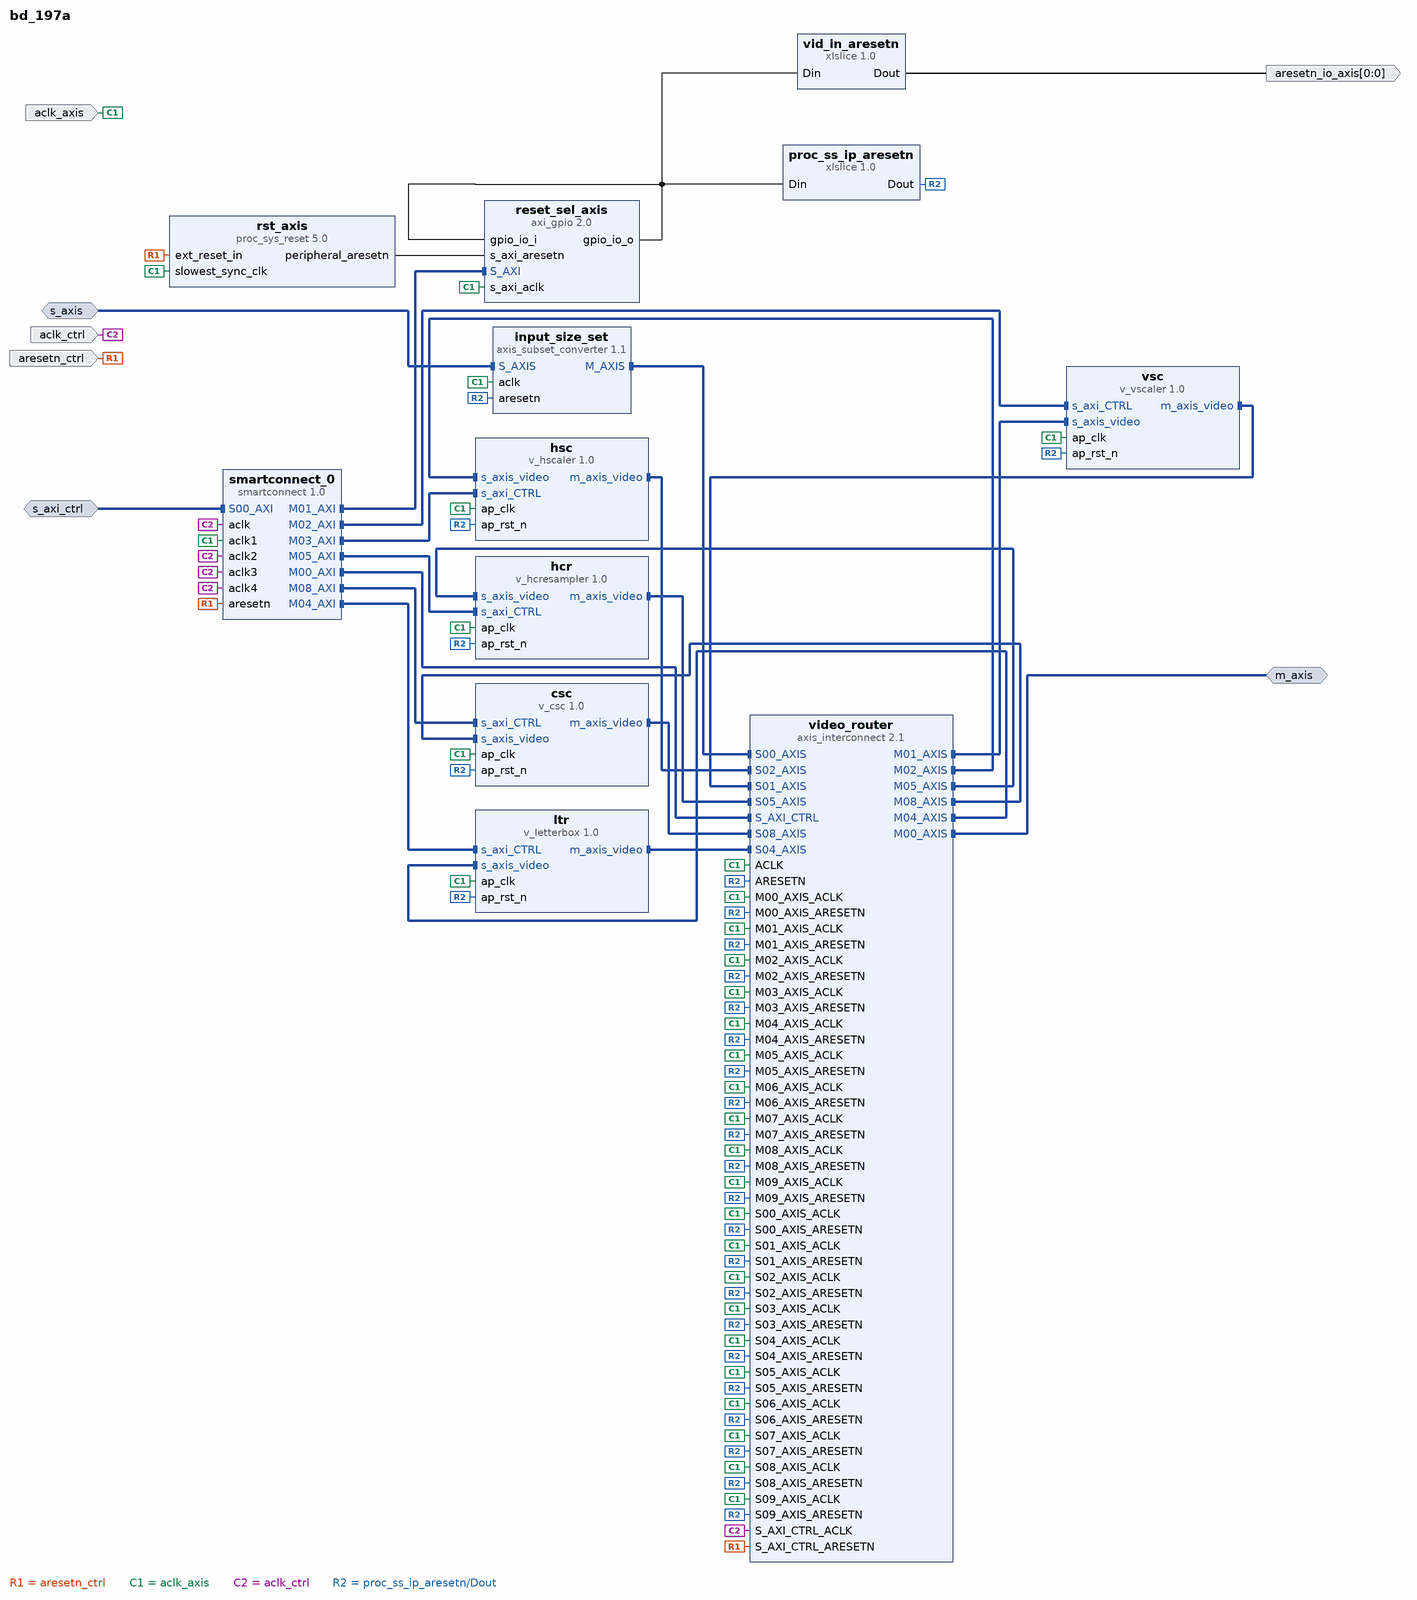
[diagram p0: block diagram of the top level]
# Vivado block design bd_197a, xc7z020clg484-1, Vivado 2020.1
create_bd_design bd_197a

create_bd_intf_port -mode Slave -vlnv xilinx.com:interface:aximm_rtl:1.0 s_axi_ctrl
set_property -dict [list \
  CONFIG.PROTOCOL AXI4LITE \
  CONFIG.ADDR_WIDTH 19 \
  CONFIG.SUPPORTS_NARROW_BURST 0 \
  CONFIG.NUM_READ_OUTSTANDING 1 \
  CONFIG.NUM_WRITE_OUTSTANDING 1 \
  CONFIG.MAX_BURST_LENGTH 1 \
  CONFIG.master_id 0 \
] [get_bd_intf_ports s_axi_ctrl]
create_bd_intf_port -mode Slave -vlnv xilinx.com:interface:axis_rtl:1.0 s_axis
create_bd_intf_port -mode Master -vlnv xilinx.com:interface:axis_rtl:1.0 m_axis
create_bd_port -dir I -type clk aclk_axis
create_bd_port -dir I -type clk aclk_ctrl
create_bd_port -dir I -type rst aresetn_ctrl
set_property -dict {CONFIG.POLARITY ACTIVE_LOW} [get_bd_ports aresetn_ctrl]
create_bd_port -dir O -from 0 -to 0 -type rst aresetn_io_axis

create_bd_cell -type ip -vlnv xilinx.com:ip:smartconnect:1.0 smartconnect_0
set_property -dict {CONFIG.HAS_ARESETN 1 CONFIG.NUM_CLKS 5 CONFIG.NUM_MI 12 CONFIG.NUM_SI 1} [get_bd_cells smartconnect_0]
create_bd_cell -type ip -vlnv xilinx.com:ip:v_vscaler:1.0 vsc
set_property -dict [list \
  CONFIG.ENABLE_420 0 \
  CONFIG.MAX_COLS 3840 \
  CONFIG.MAX_DATA_WIDTH 8 \
  CONFIG.MAX_ROWS 2160 \
  CONFIG.SAMPLES_PER_CLOCK 1 \
  CONFIG.SCALE_MODE 2 \
  CONFIG.TAPS 6 \
  CONFIG.USE_URAM 0 \
] [get_bd_cells vsc]
create_bd_cell -type ip -vlnv xilinx.com:ip:v_hscaler:1.0 hsc
set_property -dict [list \
  CONFIG.ENABLE_420 0 \
  CONFIG.ENABLE_422 1 \
  CONFIG.ENABLE_CSC 0 \
  CONFIG.MAX_COLS 3840 \
  CONFIG.MAX_DATA_WIDTH 8 \
  CONFIG.MAX_ROWS 2160 \
  CONFIG.SAMPLES_PER_CLOCK 1 \
  CONFIG.SCALE_MODE 2 \
  CONFIG.TAPS 6 \
  CONFIG.USE_URAM 0 \
] [get_bd_cells hsc]
create_bd_cell -type ip -vlnv xilinx.com:ip:axis_subset_converter:1.1 input_size_set
set_property -dict [list \
  CONFIG.M_HAS_TKEEP 1 \
  CONFIG.M_HAS_TSTRB 1 \
  CONFIG.M_TDEST_WIDTH 1 \
  CONFIG.M_TID_WIDTH 1 \
  CONFIG.S_HAS_TKEEP 1 \
  CONFIG.S_HAS_TLAST 1 \
  CONFIG.S_HAS_TSTRB 1 \
  CONFIG.S_TDATA_NUM_BYTES 3 \
  CONFIG.S_TDEST_WIDTH 1 \
  CONFIG.S_TID_WIDTH 1 \
  CONFIG.S_TUSER_WIDTH 1 \
] [get_bd_cells input_size_set]
create_bd_cell -type ip -vlnv xilinx.com:ip:v_letterbox:1.0 ltr
set_property -dict [list \
  CONFIG.MAX_COLS 3840 \
  CONFIG.MAX_DATA_WIDTH 8 \
  CONFIG.MAX_ROWS 2160 \
  CONFIG.SAMPLES_PER_CLOCK 1 \
] [get_bd_cells ltr]
create_bd_cell -type ip -vlnv xilinx.com:ip:v_csc:1.0 csc
set_property -dict [list \
  CONFIG.ENABLE_420 0 \
  CONFIG.ENABLE_422 1 \
  CONFIG.ENABLE_WINDOW 0 \
  CONFIG.MAX_DATA_WIDTH 8 \
  CONFIG.SAMPLES_PER_CLOCK 1 \
  CONFIG.USE_URAM 0 \
  CONFIG.V_CSC_MAX_HEIGHT 2160 \
  CONFIG.V_CSC_MAX_WIDTH 3840 \
] [get_bd_cells csc]
create_bd_cell -type ip -vlnv xilinx.com:ip:xlslice:1.0 proc_ss_ip_aresetn
set_property -dict {CONFIG.DIN_FROM 1 CONFIG.DIN_TO 1 CONFIG.DIN_WIDTH 2 CONFIG.DOUT_WIDTH 1} [get_bd_cells proc_ss_ip_aresetn]
create_bd_cell -type ip -vlnv xilinx.com:ip:xlslice:1.0 vid_in_aresetn
set_property -dict {CONFIG.DIN_WIDTH 2} [get_bd_cells vid_in_aresetn]
create_bd_cell -type ip -vlnv xilinx.com:ip:axis_interconnect:2.1 video_router
set_property -dict [list \
  CONFIG.ENABLE_ADVANCED_OPTIONS 1 \
  CONFIG.M00_HAS_REGSLICE 1 \
  CONFIG.M01_HAS_REGSLICE 1 \
  CONFIG.M02_HAS_REGSLICE 1 \
  CONFIG.M04_HAS_REGSLICE 1 \
  CONFIG.M05_HAS_REGSLICE 1 \
  CONFIG.M06_HAS_REGSLICE 1 \
  CONFIG.M07_HAS_REGSLICE 1 \
  CONFIG.M08_HAS_REGSLICE 1 \
  CONFIG.NUM_MI 10 \
  CONFIG.NUM_SI 10 \
  CONFIG.ROUTING_MODE 1 \
  CONFIG.S00_HAS_REGSLICE 0 \
  CONFIG.XBAR_TDATA_NUM_BYTES 3 \
] [get_bd_cells video_router]
create_bd_cell -type ip -vlnv xilinx.com:ip:axi_gpio:2.0 reset_sel_axis
set_property -dict {CONFIG.C_GPIO_WIDTH 2} [get_bd_cells reset_sel_axis]
create_bd_cell -type ip -vlnv xilinx.com:ip:proc_sys_reset:5.0 rst_axis
create_bd_cell -type ip -vlnv xilinx.com:ip:v_hcresampler:1.0 hcr
set_property -dict [list \
  CONFIG.CONVERT_TYPE 0 \
  CONFIG.MAX_COLS 3840 \
  CONFIG.MAX_DATA_WIDTH 8 \
  CONFIG.MAX_ROWS 2160 \
  CONFIG.NUM_H_TAPS 4 \
  CONFIG.SAMPLES_PER_CLOCK 1 \
] [get_bd_cells hcr]

# ---- connections ----

connect_bd_intf_net -intf_net intf_net_bdry_in_s_axi_ctrl [get_bd_intf_ports s_axi_ctrl] [get_bd_intf_pins smartconnect_0/S00_AXI]
connect_bd_intf_net -intf_net intf_net_bdry_in_s_axis [get_bd_intf_ports s_axis] [get_bd_intf_pins input_size_set/S_AXIS]
connect_bd_intf_net -intf_net intf_net_smartconnect_0_M01_AXI [get_bd_intf_pins smartconnect_0/M01_AXI] [get_bd_intf_pins reset_sel_axis/S_AXI]
connect_bd_intf_net -intf_net intf_net_hsc_m_axis_video [get_bd_intf_pins hsc/m_axis_video] [get_bd_intf_pins video_router/S02_AXIS]
connect_bd_intf_net -intf_net intf_net_hcr_m_axis_video [get_bd_intf_pins hcr/m_axis_video] [get_bd_intf_pins video_router/S05_AXIS]
connect_bd_intf_net -intf_net intf_net_video_router_M01_AXIS [get_bd_intf_pins video_router/M01_AXIS] [get_bd_intf_pins vsc/s_axis_video]
connect_bd_intf_net -intf_net intf_net_smartconnect_0_M05_AXI [get_bd_intf_pins smartconnect_0/M05_AXI] [get_bd_intf_pins hcr/s_axi_CTRL]
connect_bd_intf_net -intf_net intf_net_video_router_M02_AXIS [get_bd_intf_pins video_router/M02_AXIS] [get_bd_intf_pins hsc/s_axis_video]
connect_bd_intf_net -intf_net intf_net_smartconnect_0_M00_AXI [get_bd_intf_pins smartconnect_0/M00_AXI] [get_bd_intf_pins video_router/S_AXI_CTRL]
connect_bd_intf_net -intf_net intf_net_video_router_M04_AXIS [get_bd_intf_pins video_router/M04_AXIS] [get_bd_intf_pins ltr/s_axis_video]
connect_bd_intf_net -intf_net intf_net_video_router_M05_AXIS [get_bd_intf_pins video_router/M05_AXIS] [get_bd_intf_pins hcr/s_axis_video]
connect_bd_intf_net -intf_net intf_net_input_size_set_M_AXIS [get_bd_intf_pins input_size_set/M_AXIS] [get_bd_intf_pins video_router/S00_AXIS]
connect_bd_intf_net -intf_net intf_net_smartconnect_0_M04_AXI [get_bd_intf_pins smartconnect_0/M04_AXI] [get_bd_intf_pins ltr/s_axi_CTRL]
connect_bd_intf_net -intf_net intf_net_csc_m_axis_video [get_bd_intf_pins csc/m_axis_video] [get_bd_intf_pins video_router/S08_AXIS]
connect_bd_intf_net -intf_net intf_net_video_router_M00_AXIS [get_bd_intf_ports m_axis] [get_bd_intf_pins video_router/M00_AXIS]
connect_bd_intf_net -intf_net intf_net_smartconnect_0_M02_AXI [get_bd_intf_pins smartconnect_0/M02_AXI] [get_bd_intf_pins vsc/s_axi_CTRL]
connect_bd_intf_net -intf_net intf_net_video_router_M08_AXIS [get_bd_intf_pins video_router/M08_AXIS] [get_bd_intf_pins csc/s_axis_video]
connect_bd_intf_net -intf_net intf_net_smartconnect_0_M03_AXI [get_bd_intf_pins smartconnect_0/M03_AXI] [get_bd_intf_pins hsc/s_axi_CTRL]
connect_bd_intf_net -intf_net intf_net_smartconnect_0_M08_AXI [get_bd_intf_pins smartconnect_0/M08_AXI] [get_bd_intf_pins csc/s_axi_CTRL]
connect_bd_intf_net -intf_net intf_net_vsc_m_axis_video [get_bd_intf_pins vsc/m_axis_video] [get_bd_intf_pins video_router/S01_AXIS]
connect_bd_intf_net -intf_net intf_net_ltr_m_axis_video [get_bd_intf_pins ltr/m_axis_video] [get_bd_intf_pins video_router/S04_AXIS]
connect_bd_net -net net_bdry_in_aresetn_ctrl [get_bd_ports aresetn_ctrl] \
  [get_bd_pins smartconnect_0/aresetn] [get_bd_pins video_router/S_AXI_CTRL_ARESETN] [get_bd_pins rst_axis/ext_reset_in]
connect_bd_net -net net_bdry_in_aclk_axis [get_bd_ports aclk_axis] \
  [get_bd_pins reset_sel_axis/s_axi_aclk] [get_bd_pins hsc/ap_clk] [get_bd_pins vsc/ap_clk] [get_bd_pins ltr/ap_clk] \
  [get_bd_pins csc/ap_clk] [get_bd_pins rst_axis/slowest_sync_clk] [get_bd_pins video_router/ACLK] \
  [get_bd_pins video_router/S00_AXIS_ACLK] [get_bd_pins video_router/S01_AXIS_ACLK] [get_bd_pins video_router/S02_AXIS_ACLK] \
  [get_bd_pins video_router/S04_AXIS_ACLK] [get_bd_pins video_router/S05_AXIS_ACLK] [get_bd_pins video_router/S06_AXIS_ACLK] \
  [get_bd_pins video_router/S07_AXIS_ACLK] [get_bd_pins video_router/S08_AXIS_ACLK] [get_bd_pins video_router/M00_AXIS_ACLK] \
  [get_bd_pins video_router/M01_AXIS_ACLK] [get_bd_pins video_router/M02_AXIS_ACLK] [get_bd_pins video_router/M04_AXIS_ACLK] \
  [get_bd_pins video_router/M05_AXIS_ACLK] [get_bd_pins video_router/M06_AXIS_ACLK] [get_bd_pins video_router/M07_AXIS_ACLK] \
  [get_bd_pins video_router/M08_AXIS_ACLK] [get_bd_pins video_router/M09_AXIS_ACLK] [get_bd_pins input_size_set/aclk] \
  [get_bd_pins video_router/S03_AXIS_ACLK] [get_bd_pins video_router/M03_AXIS_ACLK] [get_bd_pins video_router/S09_AXIS_ACLK] \
  [get_bd_pins hcr/ap_clk] [get_bd_pins smartconnect_0/aclk1]
connect_bd_net -net net_bdry_in_aclk_ctrl [get_bd_ports aclk_ctrl] \
  [get_bd_pins smartconnect_0/aclk] [get_bd_pins video_router/S_AXI_CTRL_ACLK] [get_bd_pins smartconnect_0/aclk2] \
  [get_bd_pins smartconnect_0/aclk3] [get_bd_pins smartconnect_0/aclk4]
connect_bd_net -net net_rst_axis_peripheral_aresetn [get_bd_pins rst_axis/peripheral_aresetn] [get_bd_pins reset_sel_axis/s_axi_aresetn]
connect_bd_net -net net_proc_ss_ip_aresetn_Dout [get_bd_pins proc_ss_ip_aresetn/Dout] \
  [get_bd_pins vsc/ap_rst_n] [get_bd_pins hsc/ap_rst_n] [get_bd_pins ltr/ap_rst_n] [get_bd_pins csc/ap_rst_n] \
  [get_bd_pins video_router/ARESETN] [get_bd_pins video_router/S00_AXIS_ARESETN] [get_bd_pins video_router/S01_AXIS_ARESETN] \
  [get_bd_pins video_router/S02_AXIS_ARESETN] [get_bd_pins video_router/S04_AXIS_ARESETN] \
  [get_bd_pins video_router/S05_AXIS_ARESETN] [get_bd_pins video_router/S06_AXIS_ARESETN] \
  [get_bd_pins video_router/S07_AXIS_ARESETN] [get_bd_pins video_router/S08_AXIS_ARESETN] \
  [get_bd_pins video_router/M00_AXIS_ARESETN] [get_bd_pins video_router/M01_AXIS_ARESETN] \
  [get_bd_pins video_router/M02_AXIS_ARESETN] [get_bd_pins video_router/M04_AXIS_ARESETN] \
  [get_bd_pins video_router/M05_AXIS_ARESETN] [get_bd_pins video_router/M06_AXIS_ARESETN] \
  [get_bd_pins video_router/M07_AXIS_ARESETN] [get_bd_pins video_router/M08_AXIS_ARESETN] \
  [get_bd_pins video_router/M09_AXIS_ARESETN] [get_bd_pins input_size_set/aresetn] \
  [get_bd_pins video_router/S09_AXIS_ARESETN] [get_bd_pins video_router/S03_AXIS_ARESETN] \
  [get_bd_pins video_router/M03_AXIS_ARESETN] [get_bd_pins hcr/ap_rst_n]
connect_bd_net -net net_vid_in_aresetn_Dout [get_bd_pins vid_in_aresetn/Dout] [get_bd_ports aresetn_io_axis]
connect_bd_net -net net_reset_sel_axis_gpio_io_o [get_bd_pins reset_sel_axis/gpio_io_o] \
  [get_bd_pins reset_sel_axis/gpio_io_i] [get_bd_pins proc_ss_ip_aresetn/Din] [get_bd_pins vid_in_aresetn/Din]

# ---- address map ----
assign_bd_address -offset 0x00000 -range 64K -target_address_space [get_bd_addr_spaces s_axi_ctrl] [get_bd_addr_segs csc/s_axi_CTRL/Reg]
assign_bd_address -offset 0x10000 -range 64K -target_address_space [get_bd_addr_spaces s_axi_ctrl] [get_bd_addr_segs hcr/s_axi_CTRL/Reg]
assign_bd_address -offset 0x20000 -range 64K -target_address_space [get_bd_addr_spaces s_axi_ctrl] [get_bd_addr_segs hsc/s_axi_CTRL/Reg]
assign_bd_address -offset 0x30000 -range 64K -target_address_space [get_bd_addr_spaces s_axi_ctrl] [get_bd_addr_segs ltr/s_axi_CTRL/Reg]
assign_bd_address -offset 0x40000 -range 64K -target_address_space [get_bd_addr_spaces s_axi_ctrl] [get_bd_addr_segs reset_sel_axis/S_AXI/Reg]
assign_bd_address -offset 0x50000 -range 64K -target_address_space [get_bd_addr_spaces s_axi_ctrl] [get_bd_addr_segs video_router/xbar/S_AXI_CTRL/Reg]
assign_bd_address -offset 0x60000 -range 64K -target_address_space [get_bd_addr_spaces s_axi_ctrl] [get_bd_addr_segs vsc/s_axi_CTRL/Reg]

validate_bd_design
save_bd_design
